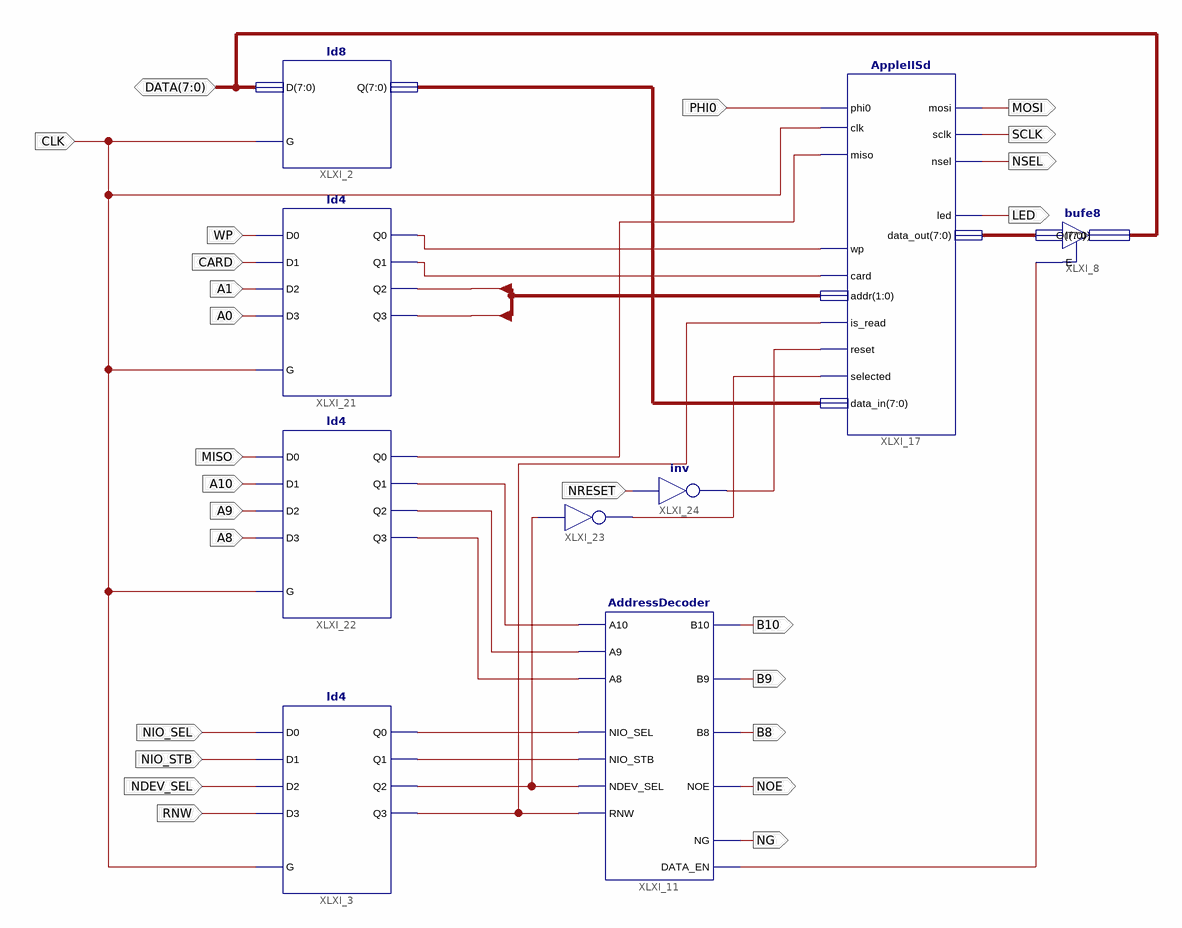
[diagram p0: schematic sheet 1]
// Xilinx ISE schematic io_buffers.sch (xc9500xl) as structural Verilog: 9 symbols, 25 ports
module io_buffers (
  input  NIO_SEL,
  input  CLK,
  input  RNW,
  input  NIO_STB,
  input  NDEV_SEL,
  input  A8,
  input  A9,
  input  A10,
  input  PHI0,
  input  MISO,
  input  A0,
  input  A1,
  input  CARD,
  input  WP,
  input  NRESET,
  inout  [7:0] DATA,
  output B10,
  output B9,
  output B8,
  output NOE,
  output NG,
  output MOSI,
  output SCLK,
  output NSEL,
  output LED
);

  wire XLXN_56, XLXN_65, XLXN_66, XLXN_77, XLXN_78, XLXN_79, XLXN_84, XLXN_100, XLXN_101, XLXN_126, XLXN_128,
       XLXN_129, XLXN_131;
  wire [1:0] add;
  wire [7:0] XLXN_52, XLXN_105;

  ld8 XLXI_2 (.D(DATA), .G(CLK), .Q(XLXN_105));
  bufe8 XLXI_8 (.E(XLXN_56), .I(XLXN_52), .O(DATA));
  AddressDecoder XLXI_11 (
    .A10(XLXN_79), .A9(XLXN_78), .A8(XLXN_77), .NIO_SEL(XLXN_65), .NDEV_SEL(XLXN_84), .RNW(XLXN_128),
    .NIO_STB(XLXN_66), .B10(B10), .B9(B9), .B8(B8), .NOE(NOE), .NG(NG), .DATA_EN(XLXN_56));
  AppleIISd XLXI_17 (
    .is_read(XLXN_128), .reset(XLXN_126), .phi0(PHI0), .selected(XLXN_129), .clk(CLK), .miso(XLXN_131),
    .wp(XLXN_101), .card(XLXN_100), .data_in(XLXN_105), .addr(add), .mosi(MOSI), .sclk(SCLK), .nsel(NSEL),
    .led(LED), .data_out(XLXN_52));
  ld4 XLXI_3 (
    .D0(NIO_SEL), .D1(NIO_STB), .D2(NDEV_SEL), .D3(RNW), .G(CLK), .Q0(XLXN_65), .Q1(XLXN_66), .Q2(XLXN_84),
    .Q3(XLXN_128));
  ld4 XLXI_21 (.D0(WP), .D1(CARD), .D2(A1), .D3(A0), .G(CLK), .Q0(XLXN_101), .Q1(XLXN_100), .Q2(add[1]), .Q3(add[0]));
  ld4 XLXI_22 (.D0(MISO), .D1(A10), .D2(A9), .D3(A8), .G(CLK), .Q0(XLXN_131), .Q1(XLXN_79), .Q2(XLXN_78), .Q3(XLXN_77));
  not XLXI_23 (XLXN_129, XLXN_84);
  not XLXI_24 (XLXN_126, NRESET);
endmodule
